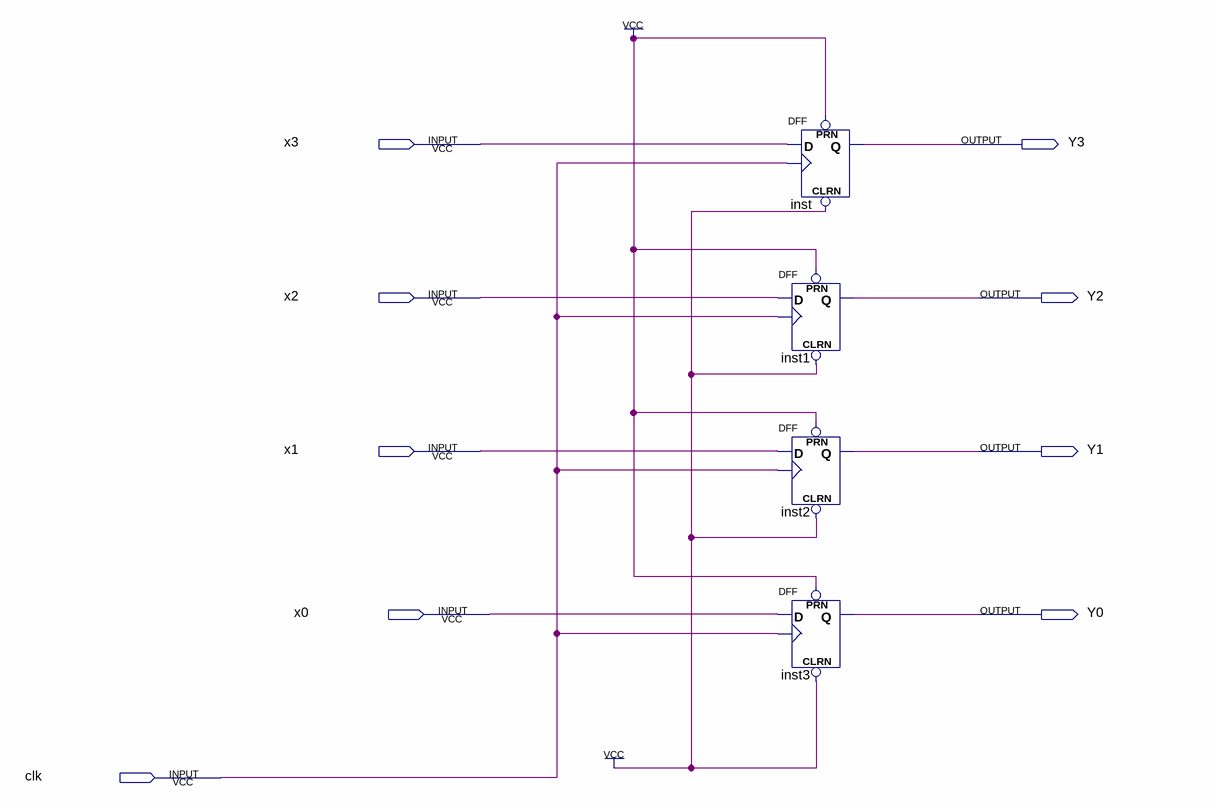
[diagram p0: schematic sheet]
// Quartus schematic register4bits.bdf as structural Verilog: 4 symbols, 9 pins
module register4bits (
  input  x3,
  input  x2,
  input  x1,
  input  x0,
  input  clk,
  output Y3,
  output Y2,
  output Y1,
  output Y0
);

  DFF inst (.CLRN(1'b1), .CLK(clk), .D(x3), .PRN(1'b1), .Q(Y3));
  DFF inst1 (.CLRN(1'b1), .CLK(clk), .D(x2), .PRN(1'b1), .Q(Y2));
  DFF inst2 (.CLRN(1'b1), .CLK(clk), .D(x1), .PRN(1'b1), .Q(Y1));
  DFF inst3 (.CLRN(1'b1), .CLK(clk), .D(x0), .PRN(1'b1), .Q(Y0));
endmodule
